# Altium schematic sheet Sheet4.SchDoc
size A4
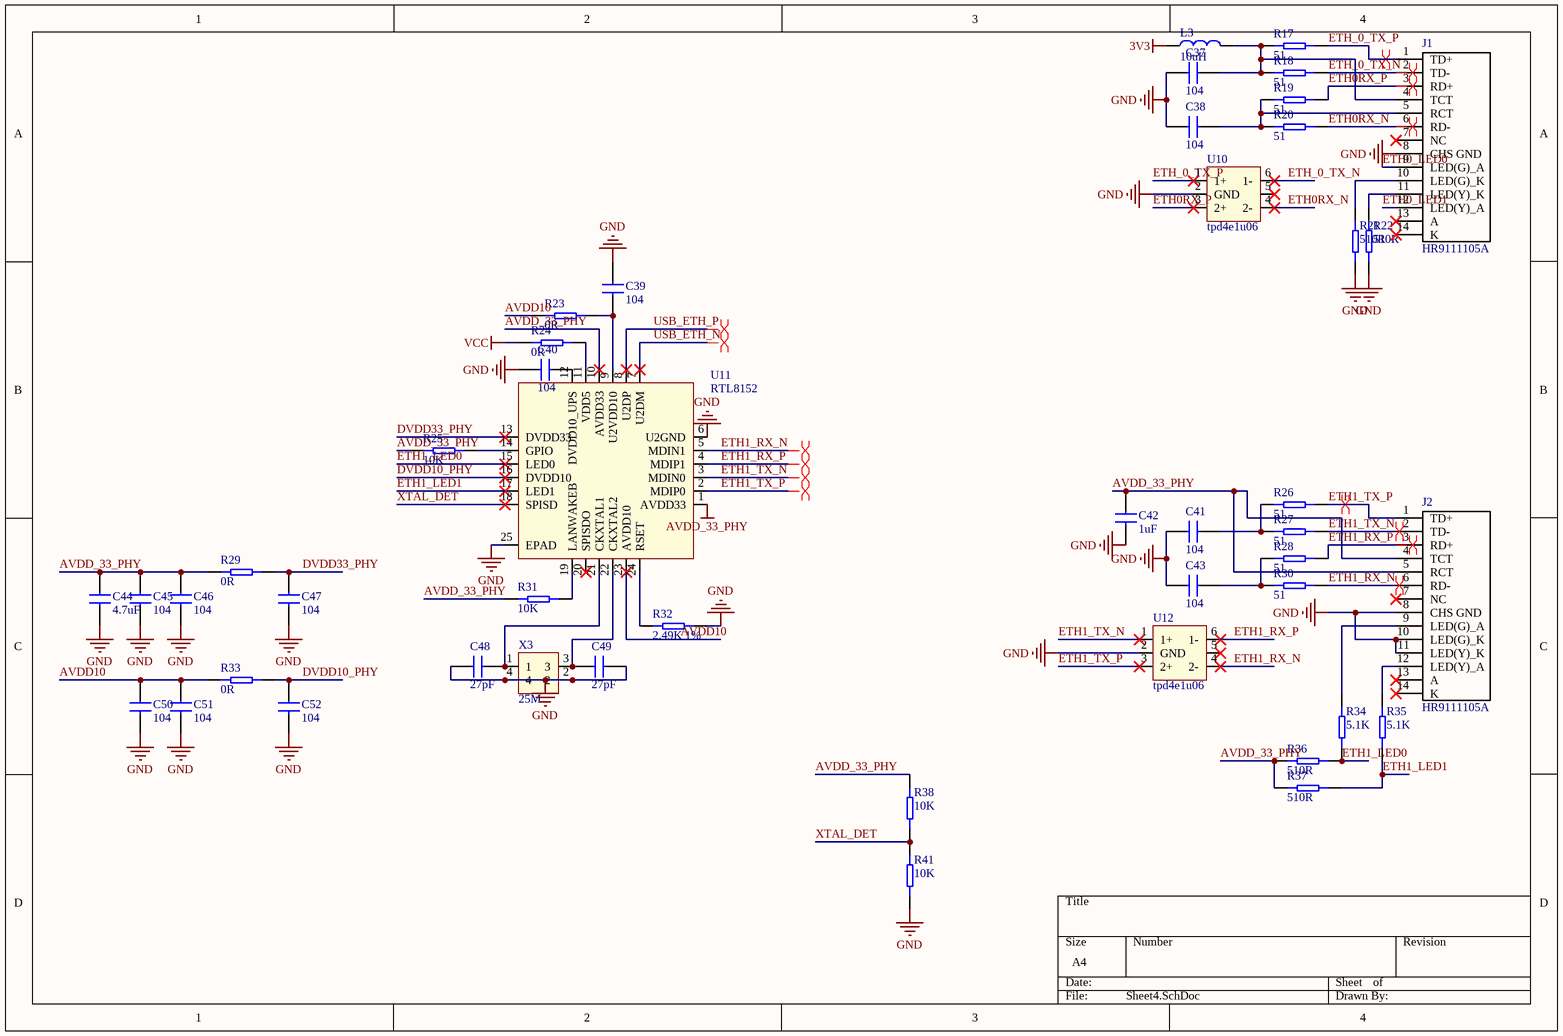
[diagram p0: Sheet4.SchDoc]

## Parts
C37  104  [0402C]
C38  104  [0402C]
C39  104  [0402C]
C40  104  [0402C]
C41  104  [0402C]
C42  1uF  [0603C]
C43  104  [0402C]
C44  4.7uF  [0603C]
C45  104  [0402C]
C46  104  [0402C]
C47  104  [0402C]
C48  27pF  [0402C]
C49  27pF  [0402C]
C50  104  [0402C]
C51  104  [0402C]
C52  104  [0402C]
J1  HR9111105A  [RJ45-HR9111105A]
J2  HR9111105A  [RJ45-HR9111105A]
L3  10uH  [0805R]
R17  51  [0402R]
R18  51  [0402R]
R19  51  [0402R]
R20  51  [0402R]
R21  510R  [0402R]
R22  510R  [0402R]
R23  0R  [0402R]
R24  0R  [0805R]
R25  10K  [0402R]
R26  51  [0402R]
R27  51  [0402R]
R28  51  [0402R]
R29  0R  [0402R]
R30  51  [0402R]
R31  10K  [0402R]
R32  2.49K 1%  [0402R]
R33  0R  [0402R]
R34  5.1K  [0402R]
R35  5.1K  [0402R]
R36  510R  [0402R]
R37  510R  [0402R]
R38  10K  [0402R]
R41  10K  [0402R]
U10  tpd4e1u06  [tpd4e1u06]
U11  RTL8152  [RTL8152B]
U12  tpd4e1u06  [tpd4e1u06]
X3  25M  [LC-SMD-3225_4P]

## Nets
3V3: L3.2
AVDD_33_PHY: C42.1 C44.1 C45.1 C46.1 J2.4(TCT) J2.5(RCT) R25.1 R29.1 R31.1 R36.2 R37.2 R38.2 U11.1(AVDD33) U11.10(AVDD33)
GND: C37.1 C38.1 C39.2 C40.1 C41.1 C42.2 C43.1 C44.2 C45.2 C46.2 C47.2 C48.1 C49.2 C50.2 C51.2 C52.2 J1.8(CHS_GND) J2.8(CHS_GND) J2.10(LED(G)_K) J2.11(LED(Y)_K) R21.1 R22.1 R32.1 R41.1 U10.2(GND) U11.6(U2GND) U11.25(EPAD) U12.2(GND) X3.2 X3.4
VCC: R24.1
AVDD10: C50.1 C51.1 R23.1 R33.1 U11.23(AVDD10)
DVDD10_PHY: C52.1 R33.2 U11.16(DVDD10)
DVDD33_PHY: C47.1 R29.2 U11.13(DVDD33)
ETH0_LED0: J1.9(LED(G)_A)
ETH0_LED1: J1.12(LED(Y)_A)
ETH0RX_N: J1.6(RD-) R20.2 U10.4(2-)
ETH0RX_P: J1.3(RD+) R19.2 U10.3(2+)
ETH1_LED0: R34.2 R36.1 U11.15(LED0)
ETH1_LED1: R35.2 R37.1 U11.17(LED1)
ETH1_RX_N: J2.6(RD-) R30.2 U11.5(MDIN1) U12.4(2-)
ETH1_RX_P: J2.3(RD+) R28.2 U11.4(MDIP1) U12.6(1-)
ETH1_TX_N: J2.2(TD-) R27.2 U11.3(MDIN0) U12.1(1+)
ETH1_TX_P: J2.1(TD+) R26.2 U11.2(MDIP0) U12.3(2+)
ETH_0_TX_N: J1.2(TD-) R18.2 U10.6(1-)
ETH_0_TX_P: J1.1(TD+) R17.2 U10.1(1+)
USB_ETH_N: U11.7(U2DM)
USB_ETH_P: U11.8(U2DP)
XTAL_DET: R38.1 R41.2 U11.18(SPISD)
NetC37_2: C37.2 J1.4(TCT) L3.1 R17.1 R18.1
NetC38_2: C38.2 J1.5(RCT) R19.1 R20.1
NetC39_1: C39.1 R23.2 U11.9(U2VDD10)
NetC40_2: C40.2 U11.12(DVDD10_UPS)
NetC41_2: C41.2 R26.1 R27.1
NetC43_2: C43.2 R28.1 R30.1
NetC48_2: C48.2 U11.21(CKXTAL1) X3.1
NetC49_1: C49.1 U11.22(CKXTAL2) X3.3
NetJ1_10: J1.10(LED(G)_K) R21.2
NetJ1_11: J1.11(LED(Y)_K) R22.2
NetJ2_9: J2.9(LED(G)_A) R34.1
NetJ2_12: J2.12(LED(Y)_A) R35.1
NetR24_2: R24.2 U11.11(VDD5)
NetR25_2: R25.2 U11.14(GPIO)
NetR31_2: R31.2 U11.19(LANWAKEB)
NetR32_2: R32.2 U11.24(RSET)

Not connected (* = marked no-connect by the designer): J1 7(NC)* 13(A)* 14(K)*; J2 7(NC)* 13(A)* 14(K)*; U10 5*; U11 20(SPISDO)*; U12 5*

## Layout directives
differential pair: ETH0RX_N, ETH0RX_P, ETH1_RX_N, ETH1_RX_P, ETH1_TX_N, ETH1_TX_P, ETH_0_TX_N, ETH_0_TX_P, USB_ETH_N, USB_ETH_P

## Library data of the parts
C37-C52 = CAP: SMD-CAP
J1 J2 = RJ45-HR9111105A
L3 = L1: 电感
R17-R38 R41 = R
X3 = XTAL-4pin